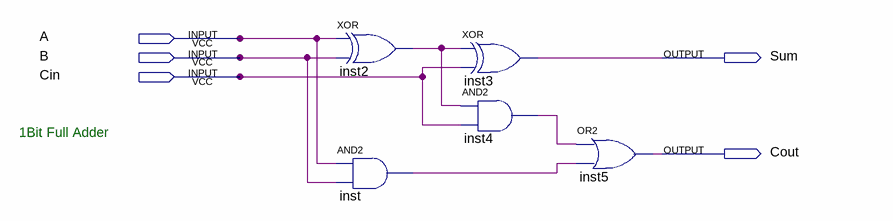
[diagram p0: schematic sheet]
// Quartus schematic FullAdder.bdf as structural Verilog: 5 symbols, 5 pins
module FullAdder (
  input  A,
  input  B,
  input  Cin,
  output Sum,
  output Cout
);

  wire inst2_out, inst4_out, inst_out;

  xor inst2 (inst2_out, A, B);
  and inst (inst_out, A, B);
  xor inst3 (Sum, inst2_out, Cin);
  and inst4 (inst4_out, inst2_out, Cin);
  or inst5 (Cout, inst4_out, inst_out);

  // Notes on the sheet:
  //   1Bit Full Adder
endmodule
